# EAGLE design SpiderHand_BendLabs (EAGLE 9.2.2)
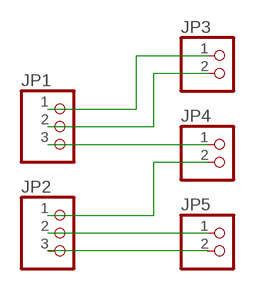
[diagram p0: schematic, sheet 1]

## Parts
JP1  PINHD-1X3  [1X03]
JP2  PINHD-1X3  [1X03]
JP3  PINHD-1X2  [1X02]
JP4  PINHD-1X2  [1X02]
JP5  PINHD-1X2  [1X02]

## Nets
GND: JP2.1 JP4.2
INT: JP2.3 JP5.2
RST: JP1.3 JP4.1
SCL: JP1.2 JP3.2
SDA: JP1.1 JP3.1
VCC: JP2.2 JP5.1

## Library data of the parts
JP1 JP2 = pinhead:PINHD-1X3: PIN HEADER
JP3-JP5 = pinhead:PINHD-1X2: PIN HEADER

## Board
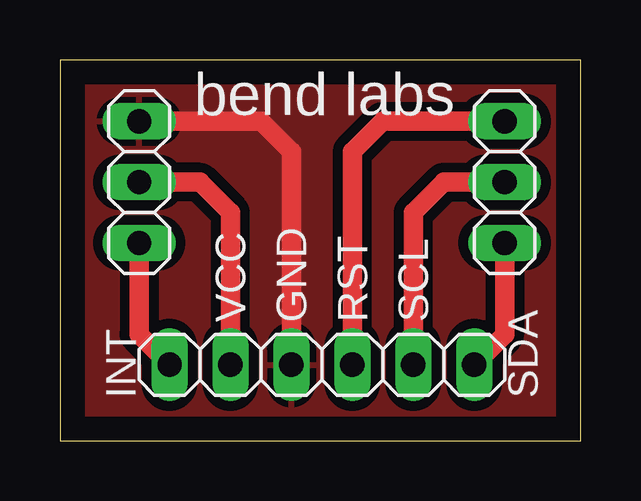
[diagram p1: board, top side]
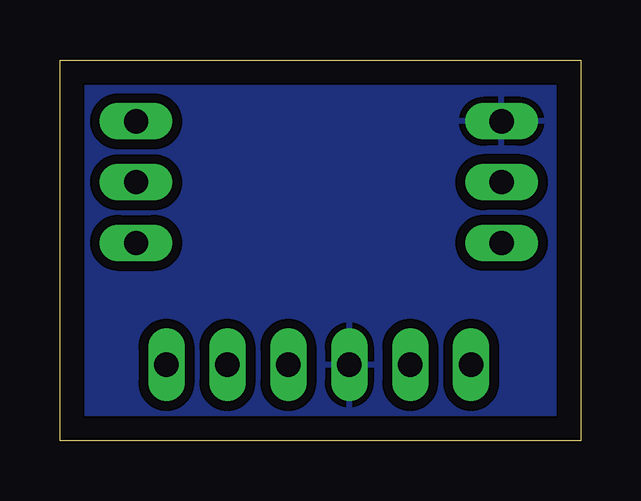
[diagram p2: board, bottom side, seen from below]

Size 21.72 x 15.89 mm. Coordinates in mm from the lower left corner, seen from the top.
Outline: 0,0 21.72,0 21.72,15.89 0,15.89 0,0
Copper layers (1*16): Top 0.035mm / dielectric 1.5mm / Bottom 0.035mm
Design rules "default": minimum track width 6mil, minimum drill 0.35mm, track to track 6mil, track to pad 6mil, pad to pad 6mil, via to via 6mil, smd to smd 6mil, copper to edge 40mil, drill to drill 6mil, minimum pad ring 10mil, minimum via ring 8mil, stop-mask expansion 4mil, vias tented up to drill 0mil, thermal gap 10mil

### Footprints (pad centres in the part's own frame; a part is rotated, then mirrored left to right if it is on the bottom)
1X03 = drill 1.016 long: 1 -2.54,0; 2 0,0; 3 2.54,0
1X02 = drill 1.016 long: 1 -1.27,0; 2 1.27,0

### Placement (x,y rotation side)
JP1  18.54,10.79 90 top
JP2  3.3,10.79 270 top
JP3  16,3.18 180 top
JP4  10.92,3.18 180 top
JP5  5.84,3.18 180 top

### Tracks (layer width: path | path; a pad name or v marks a point on that pad's centre or on a via)
GND
  Top 0.813: JP4.2 9.65,12.07 8.38,13.34 JP2.1
  Bottom 0.203: JP2.1 2.29,13.34
  pour Top (isolate 0.406): -0.38,12.07 -0.38,-0.51 21.84,-0.51 22.1,-0.51 22.1,8.51 22.1,16.26 12.19,16.26 -0.38,16.26
  pour Bottom (isolate 0.406): -0.76,14.73 -0.76,-0.76 17.27,-0.76 22.35,-0.76 22.35,12.07 22.35,16.64 12.32,16.64 -0.76,16.64
INT
  Top 0.813: JP2.3 3.3,4.45 JP5.2
RST
  Top 0.813: JP4.1 12.19,12.07 13.46,13.34 JP1.3
SCL
  Top 0.813: JP3.2 14.73,9.52 16,10.79 JP1.2
SDA
  Top 0.813: JP1.1 18.54,4.45 JP3.1
VCC
  Top 0.813: JP2.2 5.84,10.79 7.11,9.52 JP5.1

### Text on the board
tPlace: bend labs
tNames: VCC | GND | RST | SCL | INT | SDA